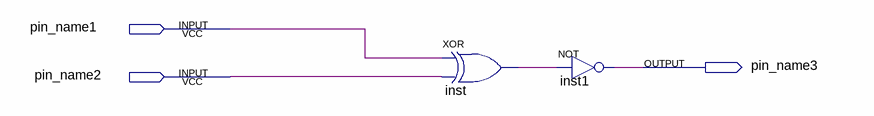
[diagram p0: schematic sheet]
// Quartus schematic bitigual.bdf as structural Verilog: 2 symbols, 3 pins
module bitigual (
  input  pin_name1,
  input  pin_name2,
  output pin_name3
);

  wire inst_out;

  xor inst (inst_out, pin_name1, pin_name2);
  not inst1 (pin_name3, inst_out);
endmodule
